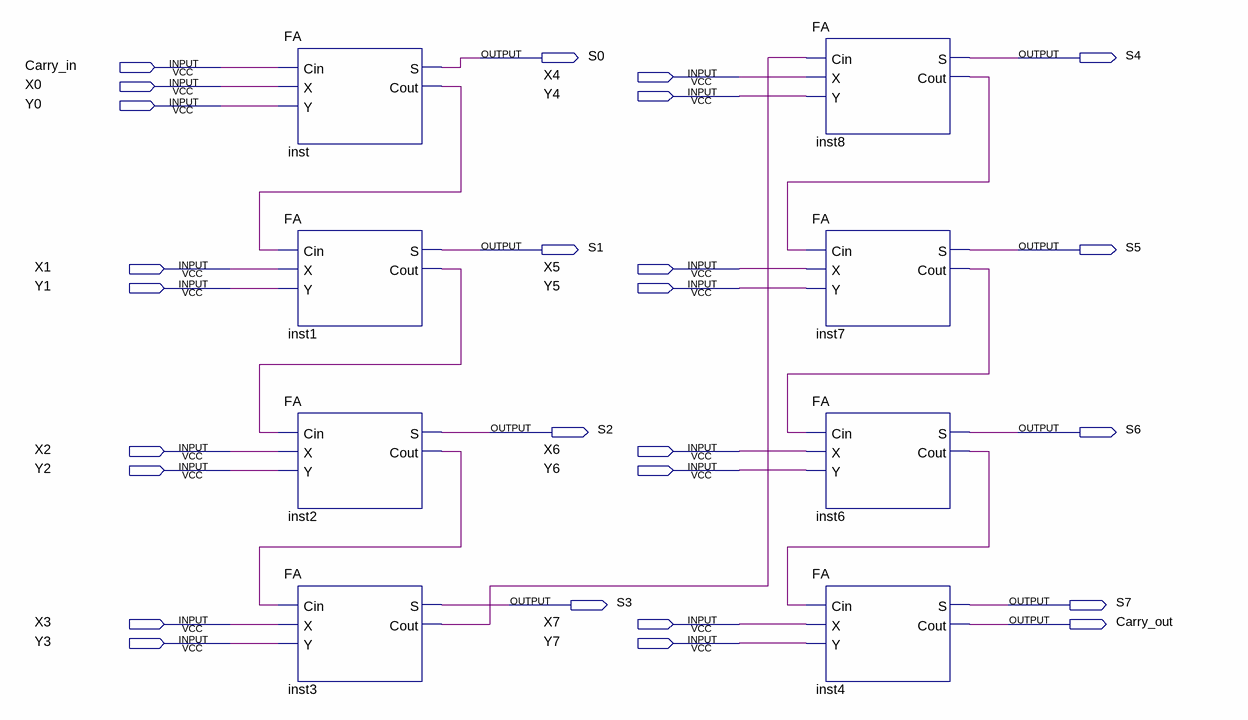
[diagram p0: schematic sheet]
// Quartus schematic 8_Bit_Adder.bdf as structural Verilog: 8 symbols, 26 pins
module \8_Bit_Adder  (
  input  Carry_in,
  input  X4,
  input  X0,
  input  Y4,
  input  Y0,
  input  X1,
  input  X5,
  input  Y1,
  input  Y5,
  input  X2,
  input  X6,
  input  Y2,
  input  Y6,
  input  X3,
  input  X7,
  input  Y3,
  input  Y7,
  output S0,
  output S4,
  output S1,
  output S5,
  output S2,
  output S6,
  output S3,
  output S7,
  output Carry_out
);

  wire inst1_cout, inst2_cout, inst3_cout, inst6_cout, inst7_cout, inst8_cout, inst_cout;

  FA inst (.Cin(Carry_in), .X(X0), .Y(Y0), .S(S0), .Cout(inst_cout));
  FA inst1 (.Cin(inst_cout), .X(X1), .Y(Y1), .S(S1), .Cout(inst1_cout));
  FA inst2 (.Cin(inst1_cout), .X(X2), .Y(Y2), .S(S2), .Cout(inst2_cout));
  FA inst3 (.Cin(inst2_cout), .X(X3), .Y(Y3), .S(S3), .Cout(inst3_cout));
  FA inst8 (.Cin(inst3_cout), .X(X4), .Y(Y4), .S(S4), .Cout(inst8_cout));
  FA inst7 (.Cin(inst8_cout), .X(X5), .Y(Y5), .S(S5), .Cout(inst7_cout));
  FA inst6 (.Cin(inst7_cout), .X(X6), .Y(Y6), .S(S6), .Cout(inst6_cout));
  FA inst4 (.Cin(inst6_cout), .X(X7), .Y(Y7), .S(S7), .Cout(Carry_out));
endmodule
